# EAGLE schematic SparkFun_Soil_Moisture_Sensor (EAGLE 8.7.0)

## Sheet 1 of 2
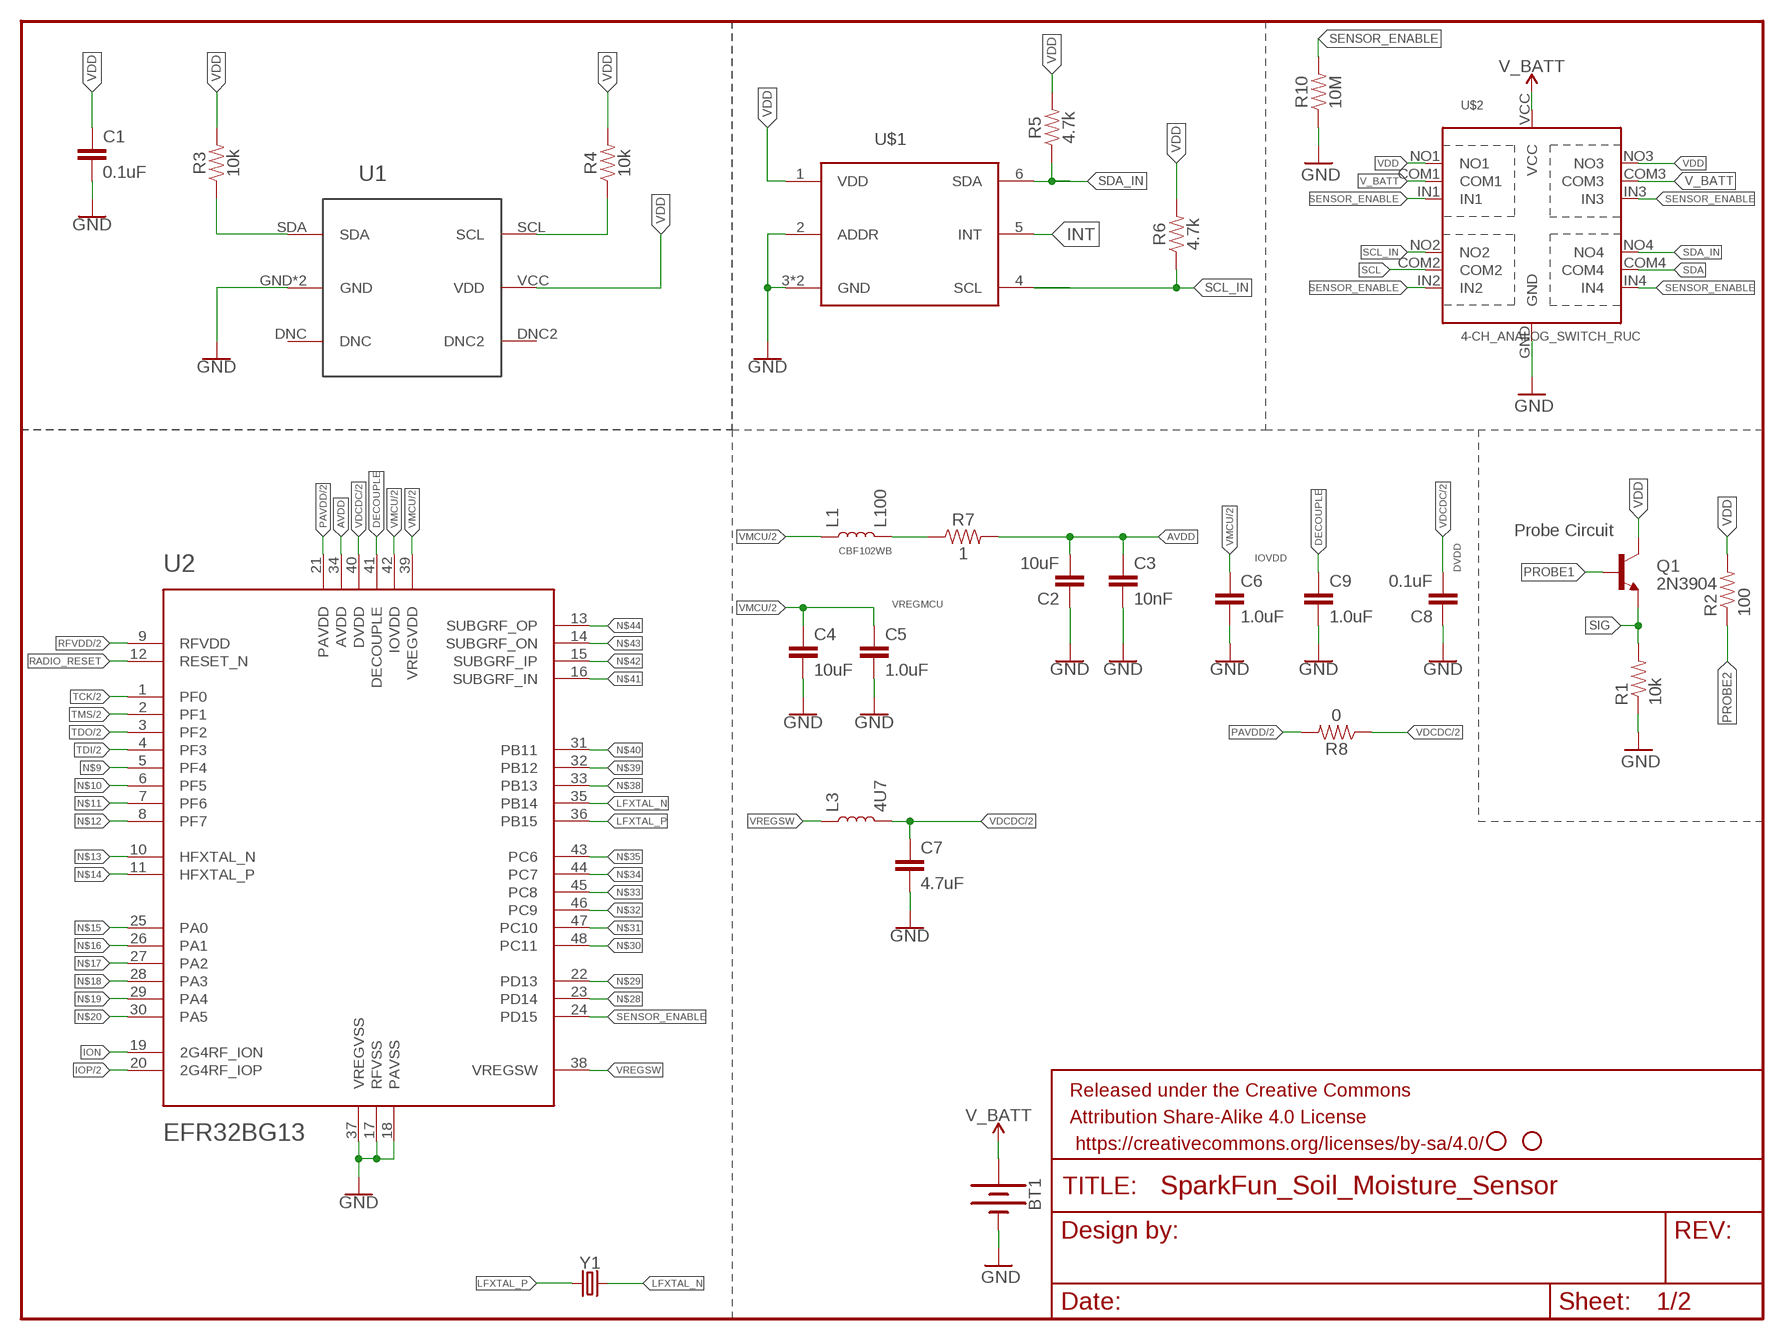
[diagram p0: schematic, sheet 1]

### Parts
BT1  BATTERY-20MM_SMD_4LEGS_OVERPASTE  [BATTCON_20MM_4LEGS_OVERPASTE]
C1  0.1uF  0.1UF-0603-25V-(+80/-20%)  [0603]
C2  10uF  10UF-0603-6.3V-20%  [0603]
C3  10nF  10NF-0603-50V-10%  [0603]
C4  10uF  10UF-0603-6.3V-20%  [0603]
C5  1.0uF  1.0UF-0603-16V-10%  [0603]
C6  1.0uF  1.0UF-0603-16V-10%  [0603]
C7  4.7uF  4.7UF0603  [0603]
C8  0.1uF  0.1UF-0603-25V-(+80/-20%)  [0603]
C9  1.0uF  1.0UF-0603-16V-10%  [0603]
FRAME1  FRAME-LETTER  [CREATIVE_COMMONS]
L1  L100  INDUCTOR-0603-33NH  [0603]
L3  4U7  [1212(3030METRIC)]
Q1  2N3904  TRANSISTOR_NPNMMBT2222A  [SOT23-3]
R1  10k  100OHM-1/4W-5%(0603)  [0603-RES]
R2  100  100OHM-1/4W-5%(0603)  [0603-RES]
R3  10k  10KOHM-0603-1/10W-1%  [0603]
R4  10k  10KOHM-0603-1/10W-1%  [0603]
R5  4.7k  4.7KOHM-0603-1/10W-1%  [0603]
R6  4.7k  4.7KOHM-0603-1/10W-1%  [0603]
R7  1  1OHM-0603-1/10W-1%  [0603]
R8  0  0OHM-0603-1/10W-5%  [0603]
R10  10M  10MOHM-0603-1/10W-5%  [0603]
STANDOFF1  STAND-OFF  [STAND-OFF]
STANDOFF2  STAND-OFF  [STAND-OFF]
U1  SI7021_TEMP_HUMIDTY  [DFN-6]
U2  EFR32BG13  [QFN48]
U$1  OPT3001DNPT  [6PIN_USON]
U$2  4-CH_ANALOG_SWITCH_RUC  [PX2QFN14_RUC]
Y1  32.768KHZ_LOW_FREQ_CRYSTAL  [CRYSTAL_1.2X0.6]

### Nets
AVDD: C2.2 C3.1 R7.2 U2.34(AVDD)
DECOUPLE: C9.1 U2.41(DECOUPLE)
GND: BT1.2(-) C1.2 C2.1 C3.2 C4.2 C5.2 C6.2 C7.2 C8.1 C9.2 R1.1 R10.1 U1.GND U1.GND2(GND) U2.17(RFVSS) U2.18(PAVSS) U2.37(VREGVSS) U$1.2(ADDR) U$1.3(GND) U$1.GND U$2.GND ; also sheet 2
INT: U$1.5(INT)
ION: U2.19(2G4RF_ION)
IOP: U2.20(2G4RF_IOP) ; also sheet 2
LFXTAL_N: U2.35(PB14) Y1.P$2
LFXTAL_P: U2.36(PB15) Y1.P$1
N$1: R4.1 U1.SCL
N$4: R3.1 U1.SDA
N$9: U2.5(PF4)
N$10: U2.6(PF5)
N$11: U2.7(PF6)
N$12: U2.8(PF7)
N$13: U2.10(HFXTAL_N)
N$14: U2.11(HFXTAL_P)
N$15: U2.25(PA0)
N$16: U2.26(PA1)
N$17: U2.27(PA2)
N$18: U2.28(PA3)
N$19: U2.29(PA4)
N$20: U2.30(PA5)
N$28: U2.23(PD14)
N$29: U2.22(PD13)
N$30: U2.48(PC11)
N$31: U2.47(PC10)
N$32: U2.46(PC9)
N$33: U2.45(PC8)
N$34: U2.44(PC7)
N$35: U2.43(PC6)
N$38: U2.33(PB13)
N$39: U2.32(PB12)
N$40: U2.31(PB11)
N$41: U2.16(SUBGRF_IN)
N$42: U2.15(SUBGRF_IP)
N$43: U2.14(SUBGRF_ON)
N$44: U2.13(SUBGRF_OP)
N$49: L1.2 R7.1
PAVDD: R8.2 U2.21(PAVDD) ; also sheet 2
PROBE1: Q1.1(B)
PROBE2: R2.1
RADIO_RESET: U2.12(RESET_N)
RFVDD: U2.9(RFVDD) ; also sheet 2
SCL: U$2.COM2
SCL_IN: R6.1 U$1.4(SCL) U$2.NO2
SDA: U$2.COM4
SDA_IN: R5.1 U$1.6(SDA) U$2.NO4
SENSOR_ENABLE: R10.2 U2.24(PD15) U$2.IN1 U$2.IN2 U$2.IN3 U$2.IN4
SIG: Q1.2(E) R1.2
TCK: U2.1(PF0) ; also sheet 2
TDI: U2.4(PF3) ; also sheet 2
TDO: U2.3(PF2) ; also sheet 2
TMS: U2.2(PF1) ; also sheet 2
V_BATT: BT1.1(+) U$2.COM1 U$2.COM3 U$2.VCC
VDCDC: C7.1 C8.2 L3.P$2 R8.1 U2.40(DVDD) ; also sheet 2
VDD: C1.1 Q1.3(C) R2.2 R3.2 R4.2 R5.2 R6.2 U1.VCC(VDD) U$1.1(VDD) U$2.NO1 U$2.NO3
VMCU: C4.1 C5.1 C6.1 L1.1 U2.39(VREGVDD) U2.42(IOVDD) ; also sheet 2
VREGSW: L3.P$1 U2.38(VREGSW)
Unconnected: U1.DNC U1.DNC2

### Notes on the sheet
- Probe Circuit
- CBF102WB
- IOVDD
- DVDD
- VREGMCU

## Sheet 2 of 2
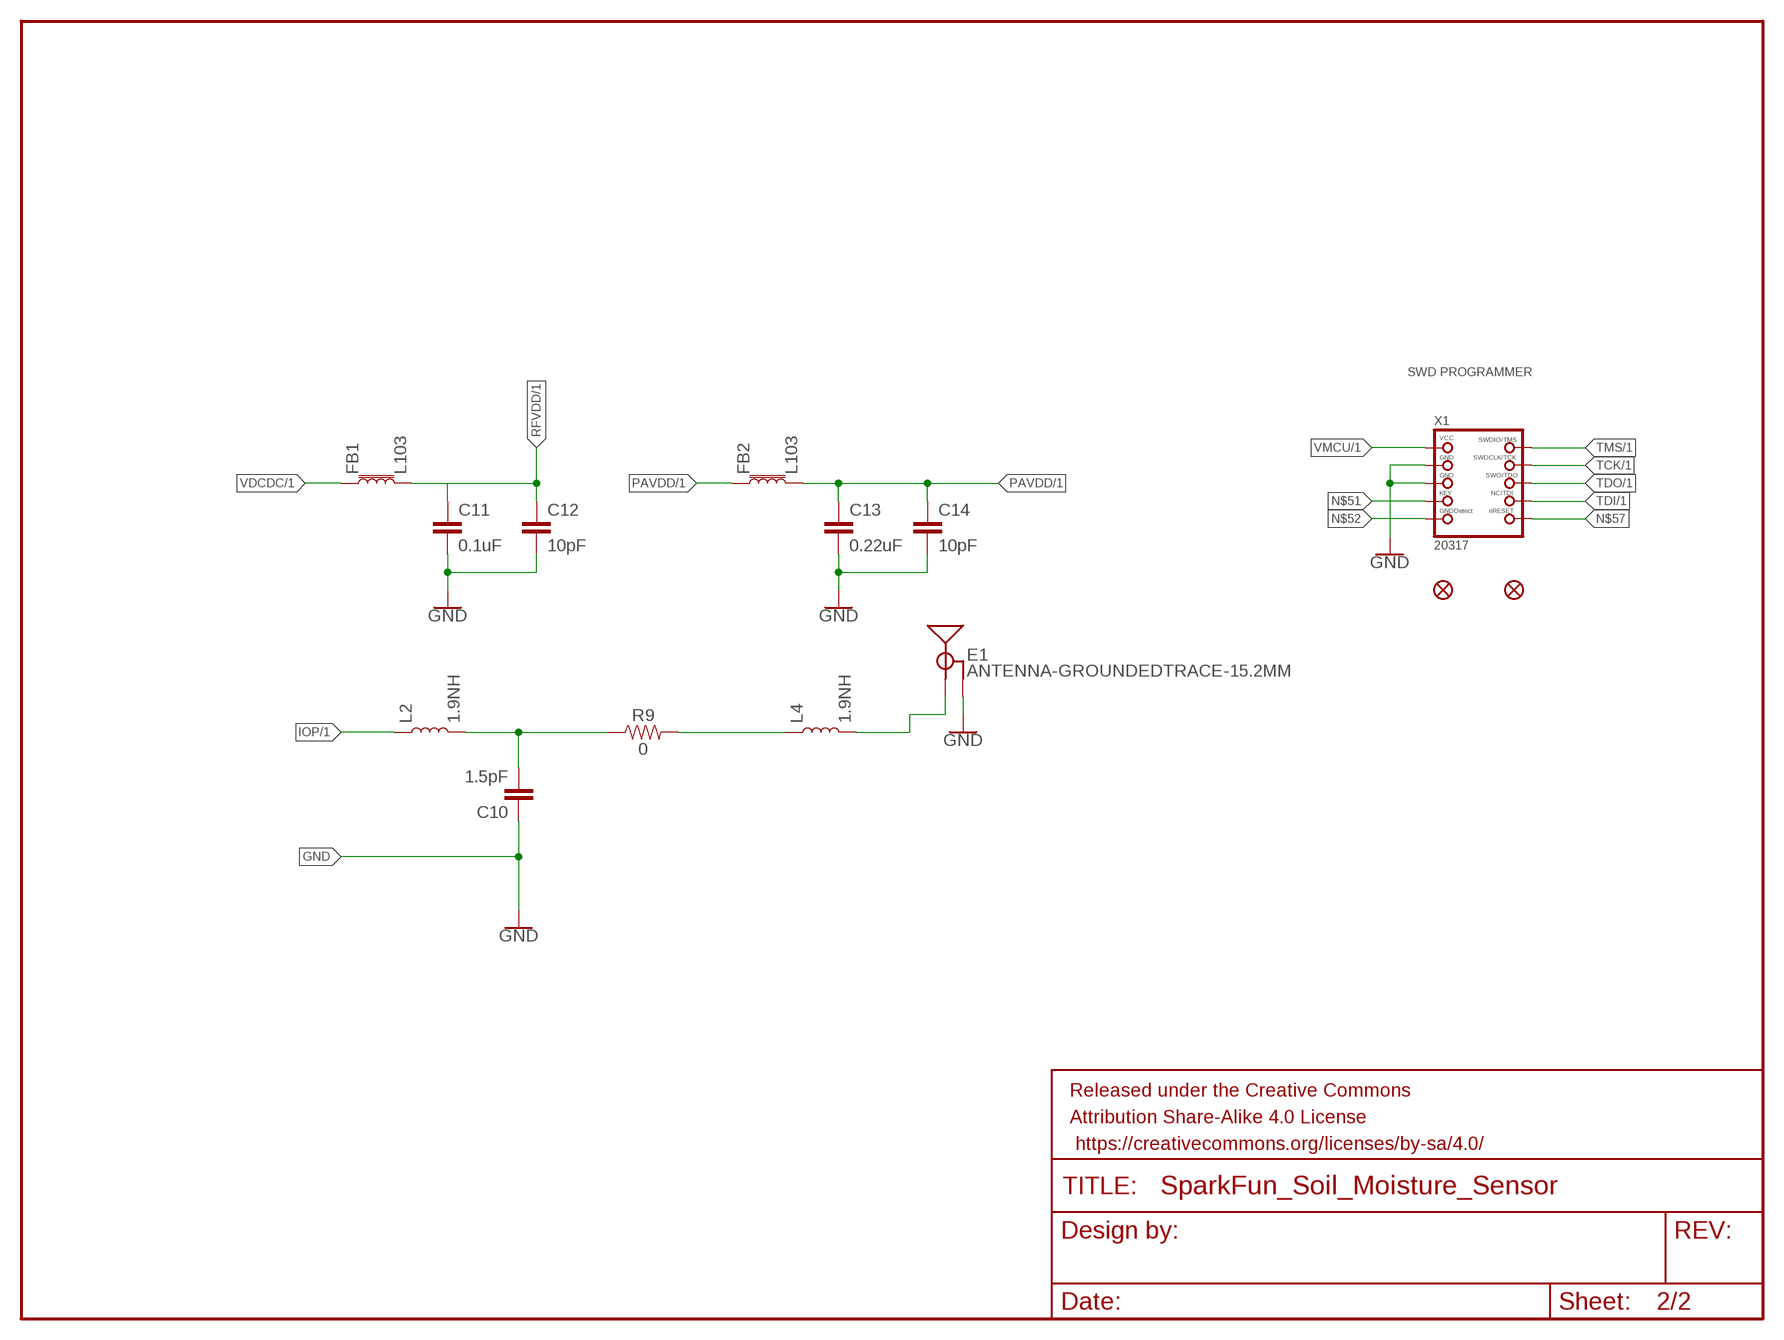
[diagram p1: schematic, sheet 2]

### Parts
C10  1.5pF  1.5PF-0603-50V-16.667%  [0603]
C11  0.1uF  0.1UF-0603-25V-(+80/-20%)  [0603]
C12  10pF  10PF-0603-50V-5%  [0603]
C13  0.22uF  0.22UF-0603-25V-10%  [0603]
C14  10pF  10PF-0603-50V-5%  [0603]
E1  ANTENNA-GROUNDEDTRACE-15.2MM  [TRACE_ANTENNA_2.4GHZ_15.2MM]
FB1  L103  FERRITE_BEAD-0603  [0603]
FB2  L103  FERRITE_BEAD-0603  [0603]
FID1  FIDUCIAL""  [FIDUCIAL_1MM]
FID2  FIDUCIAL""  [FIDUCIAL_1MM]
FRAME2  FRAME-LETTER  [CREATIVE_COMMONS]
L2  1.9NH  INDUCTOR-0402-3.9NH  [0402]
L4  1.9NH  INDUCTOR-0402-3.9NH  [0402]
R9  0  0.22OHM-0805-1/4W-1%  [0805]
X1  20317  JTAG-CORTEXBOXPOSTS  [2X05_1.27MM_BOX_POSTS]

### Nets
GND: C10.1 C11.2 C12.2 C13.2 C14.2 E1.GND X1.3(GND) X1.5(GND) ; also sheet 1
IOP: L2.1 ; also sheet 1
N$3: C10.2 L2.2 R9.1
N$23: L4.1 R9.2
N$26: E1.ANT(SIGNAL) L4.2
N$51: X1.7(KEY)
N$52: X1.9(GNDDETECT)
N$57: X1.10(NRESET)
PAVDD: C13.1 C14.1 FB2.1 FB2.2 ; also sheet 1
RFVDD: C11.1 C12.1 FB1.2 ; also sheet 1
TCK: X1.4(SWDCLK) ; also sheet 1
TDI: X1.8(TDI) ; also sheet 1
TDO: X1.6(SWO) ; also sheet 1
TMS: X1.2(SWDIO) ; also sheet 1
VDCDC: FB1.1 ; also sheet 1
VMCU: X1.1(VCC) ; also sheet 1

### Notes on the sheet
- SWD PROGRAMMER

## Library data of the parts
BT1 = SparkFun-Batteries:BATTERY: Battery - Single Cell A variety of battery chemistries, sizes, and footprints. Device List: 20MM_PTH - Coin Cell Battery Holder - 20mm (PTH) <https://www.sparkfun.com/products/783> 6.8MM_PTH - Coin Cell Battery Holder - 6.8MM(SMD) <https://www.digikey.com/product-detail/en/seiko-instruments/MS621FE-FL11E/728-1057-ND/1889208?WT.srch=1&gclid=CNOQ5a6LzdQCFZS2wAodXCkE0g> 12MM_SMD - Coin Cell Battery Holder - 12mm (SMD) <https://www.sparkfun.com/products/10592> 12MM_PTH - Coin Cell Battery Holder - 12mm (PTH) <https://www.sparkfun.com/products/7948> 20MM_SMD - 20mm Coin Cell Battery Holder (SMD) (2 legs) Used on the Big Time Watch Kit <https://www.sparkfun.com/products/11734> 20MM_SMD_4LEGS - Coin Cell Battery Holder - 20mm (SMD) <https://www.sparkfun.com/products/11892> 20MM_SMD_4LEGS_OVERPASTE - Coin Cell Battery Holder - 20mm (SMD) <https://www.sparkfun.com/products/11892> (Over-paste on the legs) 24.5MM_PTH - Coin Cell Battery Holder - 24.5mm (PTH) <https://www.sparkfun.com/products/8863> 9V - 9V Battery Holder - PC Mount Used on the SparkFun SparkPunk Sound Kit <https://www.sparkfun.com/products/11177> and SparkFun SparkPunk Sequencer Kit <https://www.sparkfun.com/products/12707> 18650 - Battery Holder - 18650 (PTH) <https://www.sparkfun.com/products/13113> AA - Battery Holder - 1xAA (PTH) <https://www.sparkfun.com/products/7949> AAA - Battery Holder - 1xAAA (PTH) <https://www.sparkfun.com/products/12718> AA_KIT - Battery Holder - 1xAA (PTH) <https://www.sparkfun.com/products/7949> Special kit package - pads only have exposed copper on one side of the board. AAA_KIT - Battery Holder - 1xAAA (PTH) <https://www.sparkfun.com/products/12718> Special kit package - pads only have exposed copper on one side of the board.; PROD_ID: PRT-11892; SF_SKU: BATT-10373
C1 C8 C11 = SparkFun-Capacitors:0.1UF: 0.1µF ceramic capacitors A capacitor is a passive two-terminal electrical component used to store electrical energy temporarily in an electric field.; PROD_ID: CAP-00810
C2 C4 = SparkFun-Capacitors:10UF: 10.0µF ceramic capacitors A capacitor is a passive two-terminal electrical component used to store electrical energy temporarily in an electric field.; PROD_ID: CAP-11015
C3 = SparkFun-Capacitors:10NF: 0.01uF/10nF/10,000pF ceramic capacitors A capacitor is a passive two-terminal electrical component used to store electrical energy temporarily in an electric field. CAP-09321; PROD_ID: CAP-00867
C5 C6 C9 = SparkFun-Capacitors:1.0UF: 1µF ceramic capacitors A capacitor is a passive two-terminal electrical component used to store electrical energy temporarily in an electric field.; PROD_ID: CAP-00868
C7 = SparkFun-Capacitors:4.7UF: 4.7µF ceramic capacitors A capacitor is a passive two-terminal electrical component used to store electrical energy temporarily in an electric field.; PROD_ID: CAP-08280
C10 = SparkFun-Capacitors:1.5PF: 1.5pF ceramic capacitors A capacitor is a passive two-terminal electrical component used to store electrical energy temporarily in an electric field.; PROD_ID: CAP-08763
C12 C14 = SparkFun-Capacitors:10PF: 10pF ceramic capacitors A capacitor is a passive two-terminal electrical component used to store electrical energy temporarily in an electric field.; PROD_ID: CAP-11812
C13 = SparkFun-Capacitors:0.22UF: 0.22µF ceramic capacitors A capacitor is a passive two-terminal electrical component used to store electrical energy temporarily in an electric field.; PROD_ID: CAP-07822
E1 = SparkFun-RF:ANTENNA-GROUNDED: Antenna w/ Ground Connection 2.4GHz antennae with signal and ground terminals. TRACE_ANTENNA_2.4GHZ_15.2MM - Meander Trace antenna 15.2 x 5.7mm footprint Based on layout from TI app note AN043 <http://www.ti.com/lit/an/swra117d/swra117d.pdf>. TRACE_ANTENNA_2.4GHZ_25.7MM - Inverted F trace antenna 25.7 x 7.5 mm footprint. Based on layout from TI design note DN0007 <http://www.ti.com/lit/an/swru120b/swru120b.pdf>.
FB1 FB2 = SparkFun-Coils:FERRITE_BEAD: Ferrite Bead (blocks, cores, rings, chokes, etc.) Inductor with layers of ferrite used to suppress high frequencies. Often used to isolate high frequency noise. SparkFun Products: IOIO-OTG - V2.2 <https://www.sparkfun.com/products/13613> SparkFun SAMD21 Mini Breakout <https://www.sparkfun.com/products/13664> SparkFun 6 Degrees of Freedom Breakout - LSM6DS3 <https://www.sparkfun.com/products/13339> SparkFun SAMD21 Dev Breakout <https://www.sparkfun.com/products/13672>; PROD_ID: NDUC-13805; VALUE: 30Ω/1.8A
FID1 FID2 = microbuilder:FIDUCIAL: Fiducial Alignment Points Various fiducial points for machine vision alignment.; BOM: EXCLUDE
FRAME1 FRAME2 = SparkFun-Aesthetics:FRAME-LETTER: Schematic Frame - Letter Standard 8.5x11 US Letter frame
L1 = SparkFun-Coils:INDUCTOR: Inductors Resist changes in electrical current. Basically a coil of wire. SparkFun Products: SparkFun Load Cell Amplifier - HX711 <https://www.sparkfun.com/products/13879> IOIO-OTG - V2.2 <https://www.sparkfun.com/products/13613>; PROD_ID: NDUC-07874; VALUE: 33nH/±5%/500mA
L2 L4 = SparkFun-Coils:INDUCTOR: Inductors Resist changes in electrical current. Basically a coil of wire. SparkFun Products: SparkFun Load Cell Amplifier - HX711 <https://www.sparkfun.com/products/13879> IOIO-OTG - V2.2 <https://www.sparkfun.com/products/13613>; PROD_ID: NDUC-13457; VALUE: 3.9NH
L3 = 4.7UH:4U7
Q1 = SparkFun-DiscreteSemi:TRANSISTOR_NPN: Generic NPN BJT MMBT2222A - TRANS-08049 (SOT-23, 1A 40V) MPSA42 - TRANS-09116 (SOT-23, 500mA 300V) MMBT5088LT1G - TRANS-11160 (SOT-23, 50 mA 30V) BC547 - COM-08928 <http://www.sparkfun.com/products/8928> (TO-92 45V 100mA) (1.Collector 2.Base 3.Emitter) 2N3904 - COM-00521 <http://www.sparkfun.com/products/521> (TO-92 40V 200mA) (1.Emitter 2.Base 3.Collector) P2N2222A - COM-12852 <http://www.sparkfun.com/products/12852> (TO-92 40V 600mA) (1.Collector 2.Base 3.Emitter); PROD_ID: TRANS-08049; VALUE: MMBT2222A
R1 R2 = SparkFun-Resistors:100OHM-1/4W-5%(0603); PROD_ID: RES-12438; VALUE: 100/.25W
R3 R4 = SparkFun-Resistors:10KOHM: 10kΩ resistor A resistor is a passive two-terminal electrical component that implements electrical resistance as a circuit element. Resistors act to reduce current flow, and, at the same time, act to lower voltage levels within circuits. - Wikipedia; PROD_ID: RES-00824
R5 R6 = SparkFun-Resistors:4.7KOHM: 4.7kΩ resistor A resistor is a passive two-terminal electrical component that implements electrical resistance as a circuit element. Resistors act to reduce current flow, and, at the same time, act to lower voltage levels within circuits. - Wikipedia; PROD_ID: RES-07857
R7 = SparkFun-Resistors:1OHM: 1Ω resistor A resistor is a passive two-terminal electrical component that implements electrical resistance as a circuit element. Resistors act to reduce current flow, and, at the same time, act to lower voltage levels within circuits. - Wikipedia; PROD_ID: RES-08269
R8 = SparkFun-Resistors:0OHM: 0Ω resistor A resistor is a passive two-terminal electrical component that implements electrical resistance as a circuit element. Resistors act to reduce current flow, and, at the same time, act to lower voltage levels within circuits. - Wikipedia; PROD_ID: RES-08609
R9 = SparkFun-Resistors:0.22OHM: 0.22Ω resistor A resistor is a passive two-terminal electrical component that implements electrical resistance as a circuit element. Resistors act to reduce current flow, and, at the same time, act to lower voltage levels within circuits. - Wikipedia; PROD_ID: RES-09883; VALUE: 0.22
R10 = SparkFun-Resistors:10MOHM: RES-09327; PROD_ID: RES-08283
STANDOFF1 STANDOFF2 = SparkFun-Electromechanical:STAND-OFF: #4 Stand Off This is the mechanical footprint for a #4 phillips button head screw. Use the keepout ring to avoid running the screw head into surrounding components. SKU : PRT-00447
U1 = Si7021_A20:SI7021_TEMP_HUMIDTY
U2 = EFR32BG13:EFR32BG13
U$1 = ALS_OPT3001:OPT3001DNPT
U$2 = 4chAnalogSwitch:4-CH_ANALOG_SWITCH_RUC
X1 = microbuilder:JTAG-CORTEX: Serial Wire (SW-DP) Connector Standard 0.05" 10-pin connector is for use with the Cortex M and Cortex A SWD (serial wire debugger) interface (SW-DP) Connectors 2x05_1.27MM_SMT - Inexpensive surface-mount header with bare pins, compatible with standard 10-pin SWD cables (4UCON: 16846) 2x05_1.27MM_BOX_NOPOSTS - Polarised surface-mount box (4UCON with caps: 19735, without caps: 15117 2x05_1.27MM_BOX_POSTS - Polarised surface-mount box with mounting holes (4UCON: 20317) Pinout: http://infocenter.arm.com/help/topic/com.arm.doc.faqs/attached/13634/cortex_debug_connectors.pdf http://www.keil.com/peripherals/coresight/connectors.asp
Y1 = Crystal_SMD_1.2x0.6:32.768KHZ_LOW_FREQ_CRYSTAL